# Altium schematic sheet power.SchDoc
size Letter
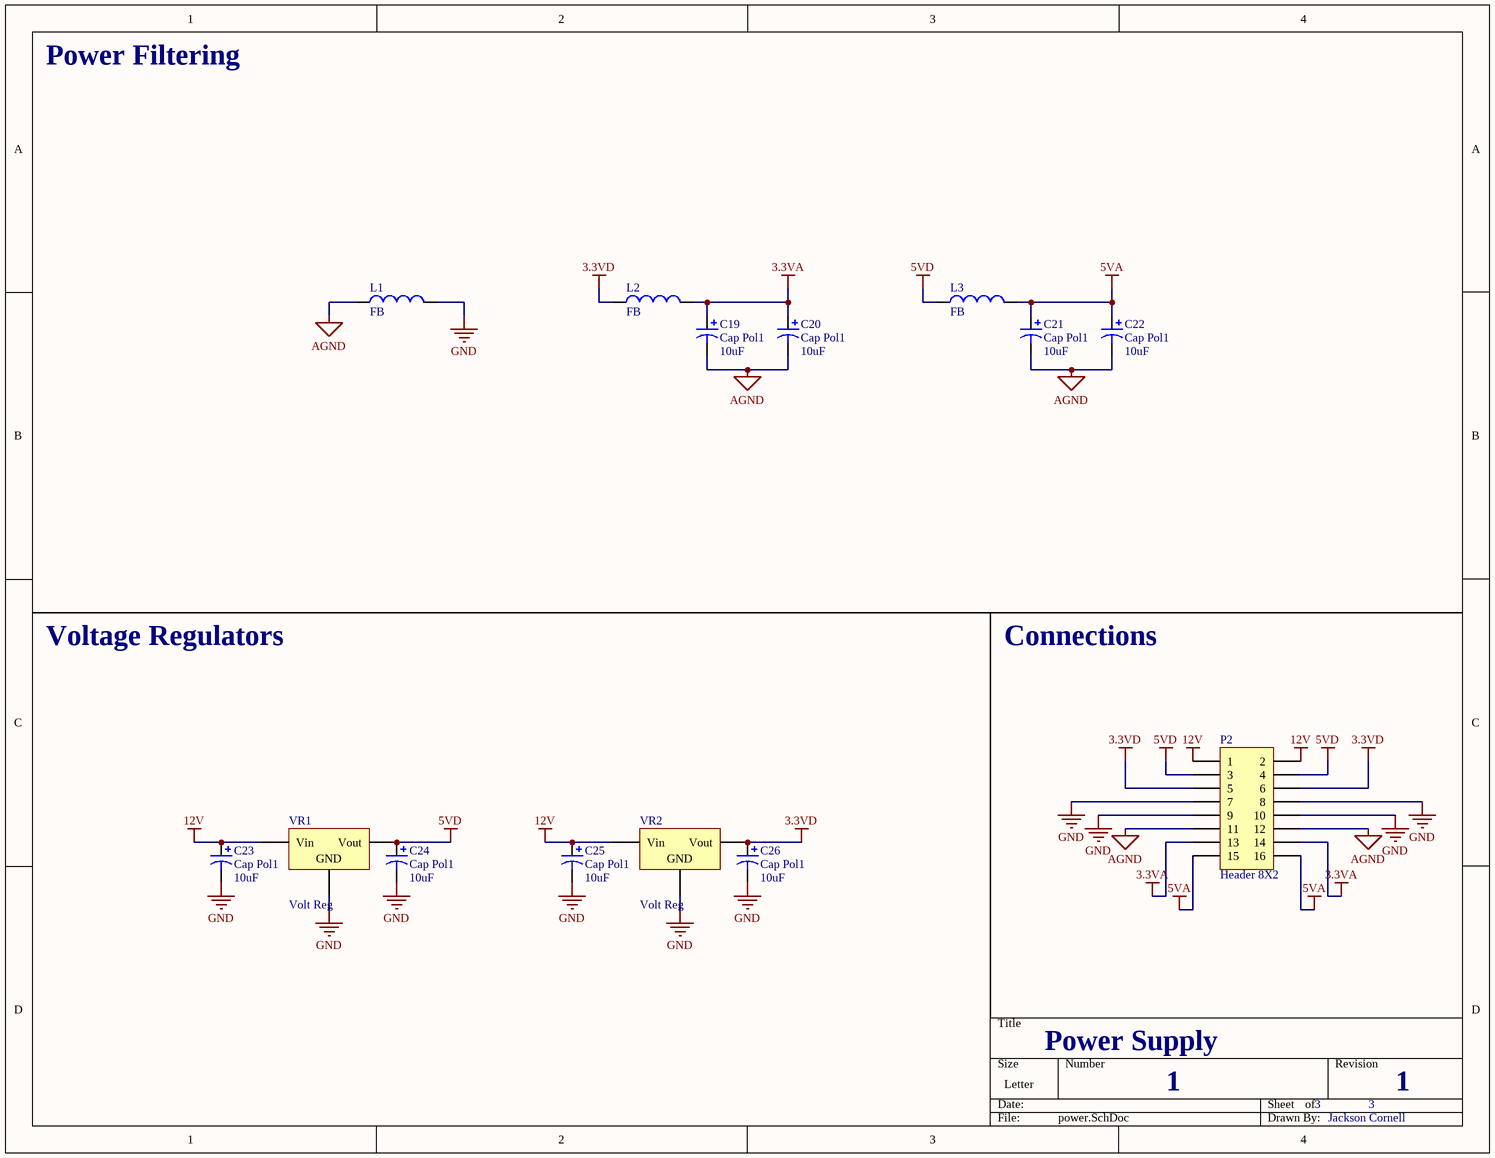
[diagram p0: power.SchDoc]

## Parts
C19  Cap Pol1  value 10uF  [RB7.6-15]
C20  Cap Pol1  value 10uF  [RB7.6-15]
C21  Cap Pol1  value 10uF  [RB7.6-15]
C22  Cap Pol1  value 10uF  [RB7.6-15]
C23  Cap Pol1  value 10uF  [RB7.6-15]
C24  Cap Pol1  value 10uF  [RB7.6-15]
C25  Cap Pol1  value 10uF  [RB7.6-15]
C26  Cap Pol1  value 10uF  [RB7.6-15]
L1  FB  [0402-A]
L2  FB  [0402-A]
L3  FB  [0402-A]
P2  Header 8X2  [HDR2X8]
VR1  Volt Reg  [D2PAK_N]
VR2  Volt Reg  [D2PAK_N]

## Nets
3.3VA: C19.1 C20.1 L2.2 P2.13 P2.14
3.3VD: C26.1 L2.1 P2.5 P2.6 VR2.3(Vout)
5VA: C21.1 C22.1 L3.2 P2.15 P2.16
5VD: C24.1 L3.1 P2.3 P2.4 VR1.3(Vout)
12V: C23.1 C25.1 P2.1 P2.2 VR1.1(Vin) VR2.1(Vin)
AGND: C19.2 C20.2 C21.2 C22.2 L1.1 P2.11 P2.12
GND: C23.2 C24.2 C25.2 C26.2 L1.2 P2.7 P2.8 P2.9 P2.10 VR1.2(GND) VR2.2(GND)

## Notes on the sheet
- Power Filtering
- Voltage Regulators
- Connections
- Power Supply
- 1
- 3
- Jackson Cornell

## Library data of the parts
C19-C26 = Cap Pol1: Polarized Capacitor (Radial); Published: 8-Jun-2000; LatestRevisionDate: 17-Jul-2002; LatestRevisionNote: Re-released for DXP Platform.; PackageReference: RB7.6-15; Publisher: Altium Limited; PackageDescription: Polarized Capacitor (Radial); 2 Leads
L1-L3 = Inductor: Code_IEC: 1005; Published: 8-Jun-2000; LatestRevisionDate: 29-May-2009; LatestRevisionNote: IPC-7351 Footprint Added.; PackageReference: 0402-A; Publisher: Altium Limited; PackageDescription: Chip Inductor; Code_JEITA: 0402
P2 = Header 8X2: Header, 8-Pin, Dual row; LatestRevisionDate: 17-Jul-2002; LatestRevisionNote: Re-released for DXP Platform.; Publisher: Altium Limited
VR1 VR2 = Volt Reg: Voltage Regulator; Published: 24-Mar-1999; LatestRevisionDate: 29-May-2009; LatestRevisionNote: IPC-7351 Footprint Added.; PackageReference: D2PAK; Publisher: Altium Limited; PackageDescription: 3-Pin Transistor Outline Package 2.54 mm Pitch, 15.1 mm Lead Span